# EAGLE design Keyboard_C64 (EAGLE 9.6.0)
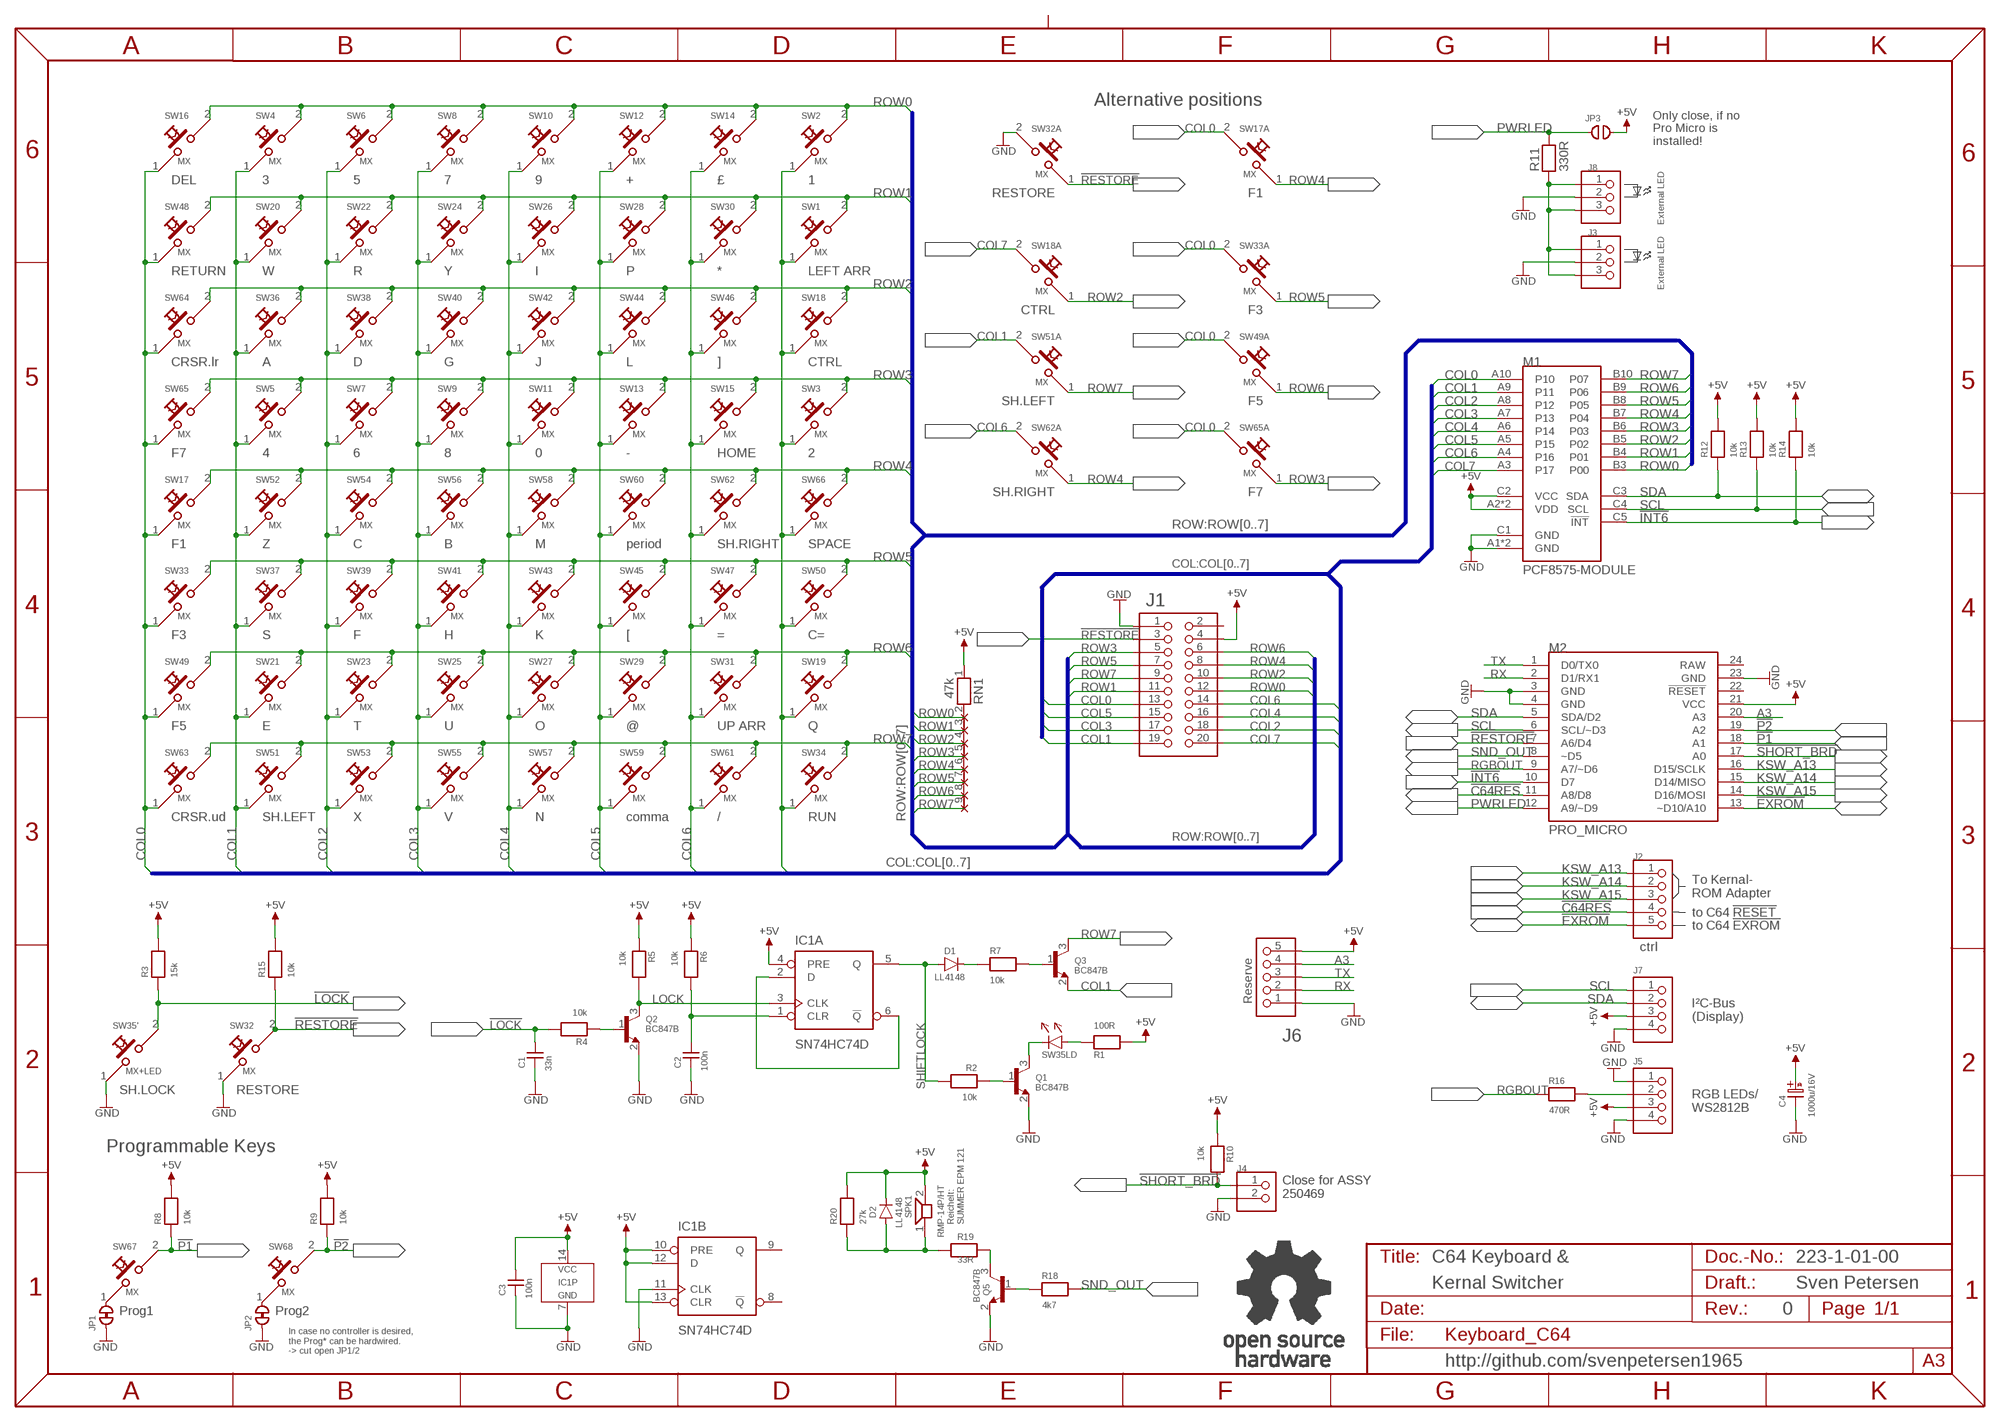
[diagram p0: schematic, sheet 1]

## Parts
C1  33n  C-0805  [0805]
C2  100n  C-0805  [0805]
C3  100n  C-0805  [0805]
C4  1000u/16V  C30X16L  [C30X16L]
D1  LL4148  [SOD80C]
D2  LL4148  [SOD80C]
IC1  SN74HC74D  7474HC  [SO-14]
J1  PINHD-2X10WH  [2X10WH]
J2  PINHD-1X590°  [1X05/90]
J3  PINHD-1X3/90  [1X03/90]
J4  PINHD-1X2/90  [1X02/90]
J5  PINHD-1X4/90  [1X04/90]
J6  PINHD-1X590°  [1X05/90]
J7  PINHD-1X4/90  [1X04/90]
J8  PINHD-1X3/90  [1X03/90]
JP1  CLOSED  [CP_CL]
JP2  CLOSED  [CP_CL]
JP3  OPEN  [CP_OP]
M1  PCF8575-MODULE  PCF8575-MODUL  [PCF8575MODUL]
M2  PRO_MICRO  [PRO_MICRO]
Q1  BC847B  BC846  [SOT23]
Q2  BC847B  BC846  [SOT23]
Q3  BC847B  BC846  [SOT23]
Q5  BC847B  BC846  [SOT23]
R1  100R  R-0805  [0805]
R2  10k  R-0805  [0805]
R3  15k  R-0805  [0805]
R4  10k  R-0805  [0805]
R5  10k  R-0805  [0805]
R6  10k  R-0805  [0805]
R7  10k  R-0805  [0805]
R8  10k  R-0805  [0805]
R9  10k  R-0805  [0805]
R10  10k  R-0805  [0805]
R11  330R  RES040805  [0805]
R12  10k  R-0805  [0805]
R13  10k  R-0805  [0805]
R14  10k  R-0805  [0805]
R15  10k  R-0805  [0805]
R16  470R  R-0805  [0805]
R18  4k7  R-0805  [0805]
R19  33R  R-0805  [0805]
R20  27k  R-0805  [0805]
RN1  47k  RN08  [RN-9]
SPK1  RMP-14P/HT  [RMP-14P/HT]
SW1  MX  [CHERRYMX]
SW2  MX  [CHERRYMX]
SW3  MX  [CHERRYMX]
SW4  MX  [CHERRYMX]
SW5  MX  [CHERRYMX]
SW6  MX  [CHERRYMX]
SW7  MX  [CHERRYMX]
SW8  MX  [CHERRYMX]
SW9  MX  [CHERRYMX]
SW10  MX  [CHERRYMX]
SW11  MX  [CHERRYMX]
SW12  MX  [CHERRYMX]
SW13  MX  [CHERRYMX]
SW14  MX  [CHERRYMX]
SW15  MX  [CHERRYMX]
SW16  MX  [CHERRYMX]
SW17  MX  [CHERRYMX]
SW17A  MX  [CHERRYMX]
SW18  MX  [CHERRYMX]
SW18A  MX  [CHERRYMX]
SW19  MX  [CHERRYMX]
SW20  MX  [CHERRYMX]
SW21  MX  [CHERRYMX]
SW22  MX  [CHERRYMX]
SW23  MX  [CHERRYMX]
SW24  MX  [CHERRYMX]
SW25  MX  [CHERRYMX]
SW26  MX  [CHERRYMX]
SW27  MX  [CHERRYMX]
SW28  MX  [CHERRYMX]
SW29  MX  [CHERRYMX]
SW30  MX  [CHERRYMX]
SW31  MX  [CHERRYMX]
SW32  MX  [CHERRYMX]
SW32A  MX  [CHERRYMX]
SW33  MX  [CHERRYMX]
SW33A  MX  [CHERRYMX]
SW34  MX  [CHERRYMX]
SW35  MX+LED  [CHERRYMXLD]
SW36  MX  [CHERRYMX]
SW37  MX  [CHERRYMX]
SW38  MX  [CHERRYMX]
SW39  MX  [CHERRYMX]
SW40  MX  [CHERRYMX]
SW41  MX  [CHERRYMX]
SW42  MX  [CHERRYMX]
SW43  MX  [CHERRYMX]
SW44  MX  [CHERRYMX]
SW45  MX  [CHERRYMX]
SW46  MX  [CHERRYMX]
SW47  MX  [CHERRYMX]
SW48  MX  [CHERRYMX]
SW49  MX  [CHERRYMX]
SW49A  MX  [CHERRYMX]
SW50  MX  [CHERRYMX]
SW51  MX  [CHERRYMX]
SW51A  MX  [CHERRYMX]
SW52  MX  [CHERRYMX]
SW53  MX  [CHERRYMX]
SW54  MX  [CHERRYMX]
SW55  MX  [CHERRYMX]
SW56  MX  [CHERRYMX]
SW57  MX  [CHERRYMX]
SW58  MX  [CHERRYMX]
SW59  MX  [CHERRYMX]
SW60  MX  [CHERRYMX]
SW61  MX  [CHERRYMX]
SW62  MX  [CHERRYMX]
SW62A  MX  [CHERRYMX]
SW63  MX  [CHERRYMX]
SW64  MX  [CHERRYMX]
SW65  MX  [CHERRYMX]
SW65A  MX  [CHERRYMX]
SW66  MX  [CHERRYMX]
SW67  MX  [CHERRYMX]
SW68  MX  [CHERRYMX]
U$90  OPEN_SOURCE_HW  [OPENHW]

## Nets
!C64RES: J2.4 M2.11(A8/D8)
!EXROM: J2.5 M2.13(~D10/A10)
!INT6: M1.C5(!INT) M2.10(D7) R14.1
!LOCK: C1.2 R3.1 R4.2 SW35.2
!P1: M2.18(A1) R8.1 SW67.2
!P2: M2.19(A2) R9.1 SW68.2
!RESTORE: J1.3 M2.7(A6/D4) R15.1 SW32.2 SW32A.1
!SHORT_BRD: J4.1 M2.17(A0) R10.2
+5V: C3.2 C4.A(+) D2.K IC1.4(A:PRE) IC1.10(B:PRE) IC1.12(B:D) IC1.13(B:CLR) IC1.14(P:VCC) J1.4 J5.3 J6.5 J7.3 JP3.2 M1.A2(VDD) M1.B2(VDD) M1.C2(VCC) M2.21(VCC) R1.2 R3.2 R5.1 R6.1 R8.2 R9.2 R10.1 R12.2 R13.2 R14.2 R15.2 R20.2 RN1.1 SPK1.2
A3: J6.4 M2.20(A3)
COL0: J1.13 M1.A10(P10) SW16.1 SW17.1 SW17A.2 SW33.1 SW33A.2 SW48.1 SW49.1 SW49A.2 SW63.1 SW64.1 SW65.1 SW65A.2
COL1: J1.19 M1.A9(P11) Q3.2(E) SW4.1 SW5.1 SW20.1 SW21.1 SW36.1 SW37.1 SW51.1 SW51A.2 SW52.1
COL2: J1.18 M1.A8(P12) SW6.1 SW7.1 SW22.1 SW23.1 SW38.1 SW39.1 SW53.1 SW54.1
COL3: J1.17 M1.A7(P13) SW8.1 SW9.1 SW24.1 SW25.1 SW40.1 SW41.1 SW55.1 SW56.1
COL4: J1.16 M1.A6(P14) SW10.1 SW11.1 SW26.1 SW27.1 SW42.1 SW43.1 SW57.1 SW58.1
COL5: J1.15 M1.A5(P15) SW12.1 SW13.1 SW28.1 SW29.1 SW44.1 SW45.1 SW59.1 SW60.1
COL6: J1.14 M1.A4(P16) SW14.1 SW15.1 SW30.1 SW31.1 SW46.1 SW47.1 SW61.1 SW62.1 SW62A.2
COL7: J1.20 M1.A3(P17) SW1.1 SW2.1 SW3.1 SW18.1 SW18A.2 SW19.1 SW34.1 SW50.1 SW66.1
GND: C1.1 C2.1 C3.1 C4.K(-) IC1.7(P:GND) IC1.11(B:CLK) J1.1 J3.2 J4.2 J5.1 J5.4 J6.1 J7.4 J8.2 JP1.1 JP2.1 M1.A1(GND) M1.B1(GND) M1.C1(GND) M2.3(GND) M2.4(GND) M2.23(GND) Q1.2(E) Q2.2(E) Q5.2(E) SW32.1 SW32A.2 SW35.1
KSW_A13: J2.1 M2.16(D15/SCLK)
KSW_A14: J2.2 M2.15(D14/MISO)
KSW_A15: J2.3 M2.14(D16/MOSI)
LOCK: IC1.3(A:CLK) Q2.3(C) R5.2
N$1: R1.1 SW35.LDA(LD:A)
N$2: Q1.3(C) SW35.LDC(LD:K)
N$3: Q1.1(B) R2.1
N$4: Q2.1(B) R4.1
N$5: IC1.2(A:D) IC1.6(A:!Q)
N$6: C2.2 IC1.1(A:CLR) R6.2
N$7: D1.K R7.1
N$8: Q3.1(B) R7.2
N$9: Q5.1(B) R18.1
N$10: J3.1 J3.3 J8.1 J8.3 R11.1
N$11: Q5.3(C) R19.2
N$12: D2.A R19.1 R20.1 SPK1.1
N$13: J5.2 R16.2
N$14: JP1.2 SW67.1
N$15: JP2.2 SW68.1
PWRLED: JP3.1 M2.12(A9/~D9) R11.2
RGBOUT: M2.9(A7/~D6) R16.1
ROW0: J1.12 M1.B3(P00) RN1.2 SW2.2 SW4.2 SW6.2 SW8.2 SW10.2 SW12.2 SW14.2 SW16.2
ROW1: J1.11 M1.B4(P01) RN1.3 SW1.2 SW20.2 SW22.2 SW24.2 SW26.2 SW28.2 SW30.2 SW48.2
ROW2: J1.10 M1.B5(P02) RN1.4 SW18.2 SW18A.1 SW36.2 SW38.2 SW40.2 SW42.2 SW44.2 SW46.2 SW64.2
ROW3: J1.5 M1.B6(P03) RN1.5 SW3.2 SW5.2 SW7.2 SW9.2 SW11.2 SW13.2 SW15.2 SW65.2 SW65A.1
ROW4: J1.8 M1.B7(P04) RN1.6 SW17.2 SW17A.1 SW52.2 SW54.2 SW56.2 SW58.2 SW60.2 SW62.2 SW62A.1 SW66.2
ROW5: J1.7 M1.B8(P05) RN1.7 SW33.2 SW33A.1 SW37.2 SW39.2 SW41.2 SW43.2 SW45.2 SW47.2 SW50.2
ROW6: J1.6 M1.B9(P06) RN1.8 SW19.2 SW21.2 SW23.2 SW25.2 SW27.2 SW29.2 SW31.2 SW49.2 SW49A.1
ROW7: J1.9 M1.B10(P07) Q3.3(C) RN1.9 SW34.2 SW51.2 SW51A.1 SW53.2 SW55.2 SW57.2 SW59.2 SW61.2 SW63.2
RX: J6.2 M2.2(D1/RX1)
SCL: J7.1 M1.C4(SCL) M2.6(SCL/~D3) R13.1
SDA: J7.2 M1.C3(SDA) M2.5(SDA/D2) R12.1
SHIFTLOCK: D1.A IC1.5(A:Q) R2.2
SND_OUT: M2.8(~D5) R18.2
TX: J6.3 M2.1(D0/TX0)
Unconnected: IC1.8(B:!Q) IC1.9(B:Q) J1.2 M2.22(!RESET)

## Buses
COL:COL[0..7]
ROW:ROW[0..7]

## Notes on the sheet
- Alternative positions
- Only close, if no
  Pro Micro is 
  installed!
- External LED
- External LED
- To Kernal-
  ROM Adapter
- to C64 !RESET
- to C64 !EXROM
- ctrl
- Reserve
- I²C-Bus
  (Display)
- RGB LEDs/
  WS2812B
- Programmable Keys
- Close for ASSY
  250469
- Reichelt:
  SUMMER EPM 121
- C64 Keyboard & | 223-1-01-00
- Kernal Switcher | Sven Petersen
- 0
- In case no controller is desired,
  the Prog* can be hardwired.
  -> cut open JP1/2
- http://github.com/svenpetersen1965

## Power pins joined to a net without a drawn wire
RAW: M2.24(RAW)

## Library data of the parts
C1-C3 = SMD:C-0805
C4 = ELCO:C30X16L
D1 D2 = Dioden:LL4148
IC1 = 74XXsmd:7474*: Dual D-Flip-Flop SO14
J1 = PINHEAD:PINHD-2X10
J2 J6 = PINHEAD:PINHD-1X5
J3 J8 = PINHEAD:PINHD-1X3
J4 = PINHEAD:PINHD-1X2
J5 J7 = PINHEAD:PINHD-1X4
JP1 JP2 = Cutpad:CLOSED: Closed Cutpad
JP3 = Cutpad:OPEN: open Cutpad
M1 = Arduino:PCF8575-MODUL
M2 = Arduino:PRO_MICRO
Q1-Q3 Q5 = Transistoren:BC846
R1-R10 R12-R16 R18-R20 = SMD:R-0805
R11 = DISCRETE:RES04
RN1 = DISCRETE:RN08
SPK1 = KM:RMP-14P/HT
SW1 = CherryMX:MX; KEY: LEFT ARR
SW2 = CherryMX:MX; KEY: 1
SW3 = CherryMX:MX; KEY: 2
SW4 = CherryMX:MX; KEY: 3
SW5 = CherryMX:MX; KEY: 4
SW6 = CherryMX:MX; KEY: 5
SW7 = CherryMX:MX; KEY: 6
SW8 = CherryMX:MX; KEY: 7
SW9 = CherryMX:MX; KEY: 8
SW10 = CherryMX:MX; KEY: 9
SW11 = CherryMX:MX; KEY: 0
SW12 = CherryMX:MX; KEY: +
SW13 = CherryMX:MX; KEY: -
SW14 = CherryMX:MX; KEY: £
SW15 = CherryMX:MX; KEY: HOME
SW16 = CherryMX:MX; KEY: DEL
SW17 SW17A = CherryMX:MX; KEY: F1
SW18 SW18A = CherryMX:MX; KEY: CTRL
SW19 = CherryMX:MX; KEY: Q
SW20 = CherryMX:MX; KEY: W
SW21 = CherryMX:MX; KEY: E
SW22 = CherryMX:MX; KEY: R
SW23 = CherryMX:MX; KEY: T
SW24 = CherryMX:MX; KEY: Y
SW25 = CherryMX:MX; KEY: U
SW26 = CherryMX:MX; KEY: I
SW27 = CherryMX:MX; KEY: O
SW28 = CherryMX:MX; KEY: P
SW29 = CherryMX:MX; KEY: @
SW30 = CherryMX:MX; KEY: *
SW31 = CherryMX:MX; KEY: UP ARR
SW32 SW32A = CherryMX:MX; KEY: RESTORE
SW33 SW33A = CherryMX:MX; KEY: F3
SW34 = CherryMX:MX; KEY: RUN
SW35 = CherryMX:MX+LED; KEY: SH.LOCK
SW36 = CherryMX:MX; KEY: A
SW37 = CherryMX:MX; KEY: S
SW38 = CherryMX:MX; KEY: D
SW39 = CherryMX:MX; KEY: F
SW40 = CherryMX:MX; KEY: G
SW41 = CherryMX:MX; KEY: H
SW42 = CherryMX:MX; KEY: J
SW43 = CherryMX:MX; KEY: K
SW44 = CherryMX:MX; KEY: L
SW45 = CherryMX:MX; KEY: [
SW46 = CherryMX:MX; KEY: ]
SW47 = CherryMX:MX; KEY: =
SW48 = CherryMX:MX; KEY: RETURN
SW49 SW49A = CherryMX:MX; KEY: F5
SW50 = CherryMX:MX; KEY: C=
SW51 SW51A = CherryMX:MX; KEY: SH.LEFT
SW52 = CherryMX:MX; KEY: Z
SW53 = CherryMX:MX; KEY: X
SW54 = CherryMX:MX; KEY: C
SW55 = CherryMX:MX; KEY: V
SW56 = CherryMX:MX; KEY: B
SW57 = CherryMX:MX; KEY: N
SW58 = CherryMX:MX; KEY: M
SW59 = CherryMX:MX; KEY: comma
SW60 = CherryMX:MX; KEY: period
SW61 = CherryMX:MX; KEY: /
SW62 SW62A = CherryMX:MX; KEY: SH.RIGHT
SW63 = CherryMX:MX; KEY: CRSR.ud
SW64 = CherryMX:MX; KEY: CRSR.lr
SW65 SW65A = CherryMX:MX; KEY: F7
SW66 = CherryMX:MX; KEY: SPACE
SW67 = CherryMX:MX; KEY: Prog1
SW68 = CherryMX:MX; KEY: Prog2
U$90 = Logo:OPEN_SOURCE_HW

## Board
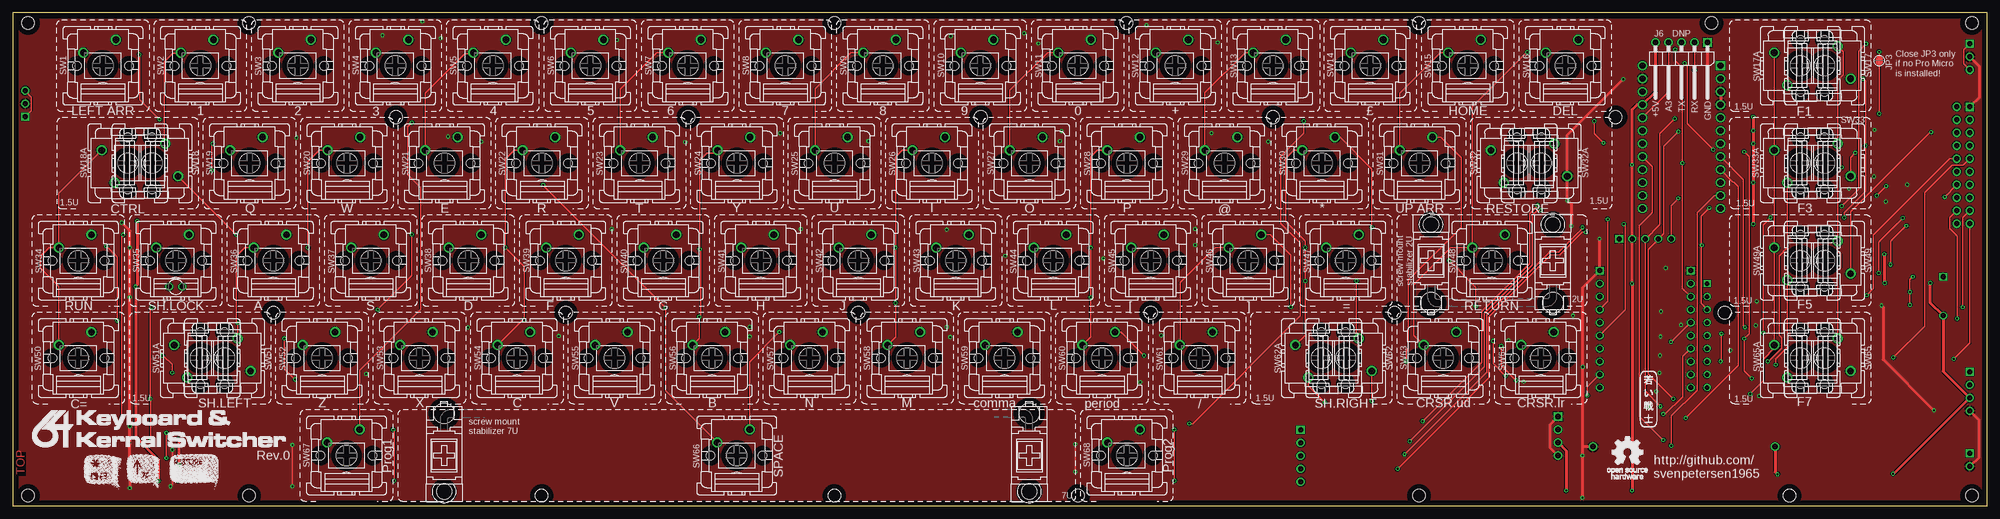
[diagram p1: board, top side]
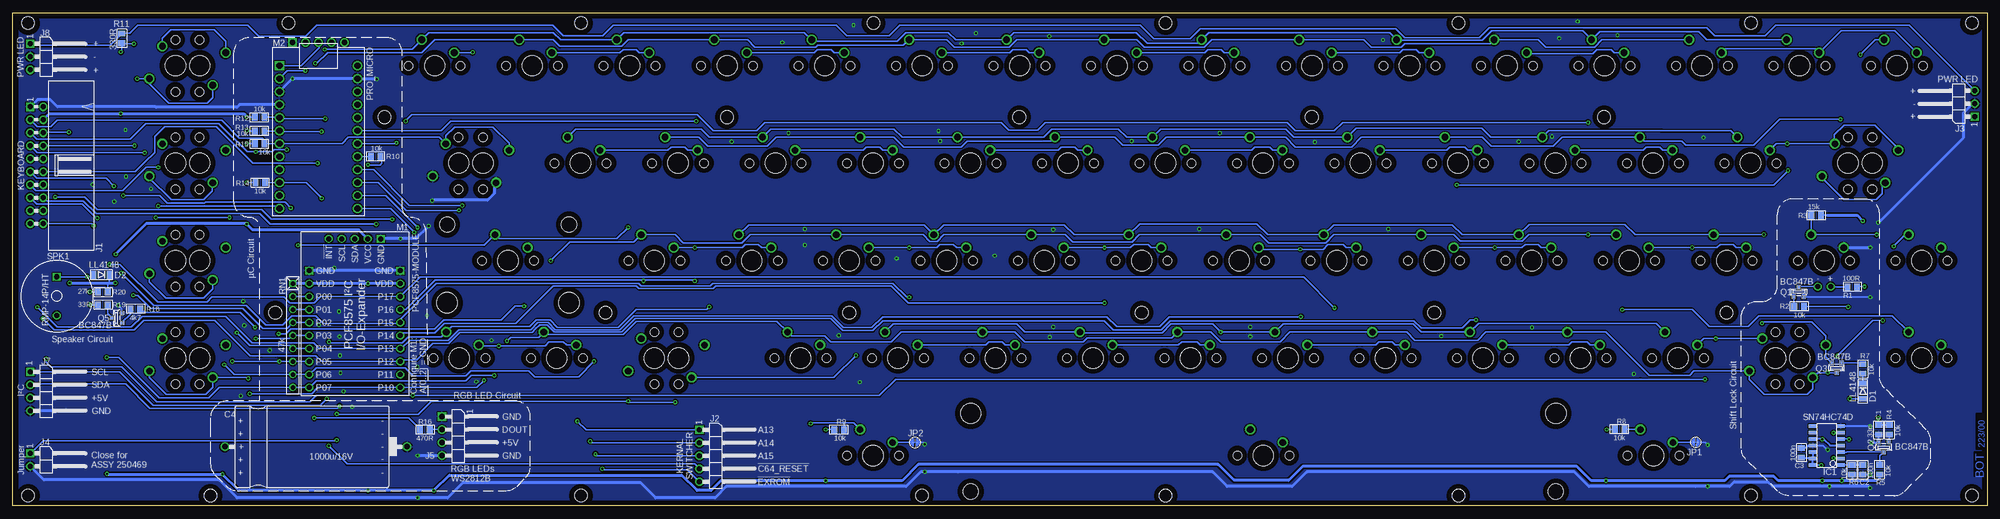
[diagram p2: board, bottom side, seen from below]

Size 385.6 x 96.4 mm. Coordinates in mm from the lower left corner, seen from the top.
Outline: 0,0 385.6,0 385.6,96.4 0,96.4 0,0
Copper layers (1*16): Top 0.035mm / dielectric 1.5mm / Bottom 0.035mm
Design rules "default *": minimum track width 6mil, minimum drill 0.35mm, track to track 6mil, track to pad 6mil, pad to pad 6mil, via to via 6mil, smd to smd 6mil, copper to edge 40mil, drill to drill 6mil, minimum pad ring 10mil, minimum via ring 8mil, stop-mask expansion 4mil, vias tented up to drill 25mil, thermal gap 10mil
Holes 2.5 mm at 3,94.4 3,2 46.16,94.4 103.29,94.4 160.44,94.4 217.52,94.4 274.64,94.4 331.76,94.4 382.6,94.4 46.16,2 103.29,2 160.44,2 208.06,2 274.64,2 347,2 382.6,2 74.8,76 131.92,76 189.04,76 246.14,76 313,76 50.88,37.8 108,37.8 165.12,37.8 222.24,37.8 269.84,37.8 334.34,37.8
tRestrict: area 1,92.4 to 5,96.4; area 44.2,92.4 to 48.2,96.4; area 101.3,92.4 to 105.3,96.4; area 158.4,92.4 to 162.4,96.4; area 215.5,92.4 to 219.5,96.4; area 272.6,92.4 to 276.6,96.4; area 329.8,92.4 to 333.8,96.4; area 380.6,92.4 to 384.6,96.4; area 72.8,74 to 76.8,78; area 129.9,74 to 133.9,78; area 187,74 to 191,78; area 244.1,74 to 248.1,78; area 311,74 to 315,78; area 48.9,35.8 to 52.9,39.8; area 106,35.8 to 110,39.8; area 163.1,35.8 to 167.1,39.8; area 220.2,35.8 to 224.2,39.8; area 267.8,35.8 to 271.8,39.8; area 332.3,35.8 to 336.3,39.8; area 380.6,0 to 384.6,4; area 272.6,0 to 276.6,4; area 206.1,0 to 210.1,4; area 158.4,0 to 162.4,4; area 101.3,0 to 105.3,4; area 44.2,0 to 48.2,4; area 1,0 to 5,4; area 345,0 to 349,4; area 82.2,0.8 to 86.2,4.8; area 196.5,0.8 to 200.5,4.8; area 275,53 to 279,57; area 298.8,53 to 302.8,57
bRestrict: area 1,92.4 to 5,96.4; area 44.2,92.4 to 48.2,96.4; area 101.3,92.4 to 105.3,96.4; area 158.4,92.4 to 162.4,96.4; area 215.5,92.4 to 219.5,96.4; area 272.6,92.4 to 276.6,96.4; area 329.8,92.4 to 333.8,96.4; area 380.6,92.4 to 384.6,96.4; area 72.8,74 to 76.8,78; area 129.9,74 to 133.9,78; area 187,74 to 191,78; area 244.1,74 to 248.1,78; area 311,74 to 315,78; area 48.9,35.8 to 52.9,39.8; area 106,35.8 to 110,39.8; area 163.1,35.8 to 167.1,39.8; area 220.2,35.8 to 224.2,39.8; area 267.8,35.8 to 271.8,39.8; area 332.3,35.8 to 336.3,39.8; area 380.6,0 to 384.6,4; area 272.6,0 to 276.6,4; area 206.1,0 to 210.1,4; area 158.4,0 to 162.4,4; area 101.3,0 to 105.3,4; area 44.2,0 to 48.2,4; area 1,0 to 5,4; area 345,0 to 349,4; area 82.2,0.8 to 86.2,4.8; area 196.5,0.8 to 200.5,4.8; area 275,53 to 279,57; area 298.8,53 to 302.8,57; 3 lines

### Footprints (pad centres in the part's own frame; a part is rotated, then mirrored left to right if it is on the bottom)
0805 = smd 1.092 x 1.397: 1 -0.94,0; 2 0.94,0
C30X16L = drill 1.016 pad 1.651: A -17.78,0; K 17.78,0
SOD80C = smd 1 x 1.6: A -1.5,0; K 1.5,0
SO-14 = smd 0.61 x 1.524: 1 -3.81,-2.794; 2 -2.54,-2.794; 3 -1.27,-2.794; 4 0,-2.794; 5 1.27,-2.794; 6 2.54,-2.794; 7 3.81,-2.794; 8 3.81,2.667; 9 2.54,2.667; 10 1.27,2.667; 11 0,2.667; 12 -1.27,2.667; 13 -2.54,2.667; 14 -3.81,2.667
2X10WH = drill 1 pad 1.626 square: 1 -11.43,-1.27 | drill 1 pad 1.626: 2 -11.43,1.27; 3 -8.89,-1.27; 4 -8.89,1.27; 5 -6.35,-1.27; 6 -6.35,1.27; 7 -3.81,-1.27; 8 -3.81,1.27; 9 -1.27,-1.27; 10 -1.27,1.27; 11 1.27,-1.27; 12 1.27,1.27; 13 3.81,-1.27; 14 3.81,1.27; 15 6.35,-1.27; 16 6.35,1.27; 17 8.89,-1.27; 18 8.89,1.27; 19 11.43,-1.27; 20 11.43,1.27
1X05/90 = drill 1 pad 1.626 square: 1 -5.08,0 | drill 1 pad 1.626: 2 -2.54,0; 3 0,0; 4 2.54,0; 5 5.08,0
1X03/90 = drill 1 pad 1.626 square: 1 -2.54,0 | drill 1 pad 1.626: 2 0,0; 3 2.54,0
1X02/90 = drill 1 pad 1.626 square: 1 -1.27,0 | drill 1 pad 1.626: 2 1.27,0
1X04/90 = drill 1 pad 1.626 square: 1 -3.81,0 | drill 1 pad 1.626: 2 -1.27,0; 3 1.27,0; 4 3.81,0
CP_CL = smd 0.152 x 0.152: 1 -0.4,0; 2 0.4,0
CP_OP = smd 0.152 x 0.152: 1 -0.4,0; 2 0.4,0
PCF8575MODUL = drill 1 square: A1 -8.89,-8.5; B1 8.89,-8.5; C1 -5.08,-14.7 | drill 1: A2 -8.89,-5.96; A3 -8.89,-3.42; A4 -8.89,-0.88; A5 -8.89,1.66; A6 -8.89,4.2; A7 -8.89,6.74; A8 -8.89,9.28; A9 -8.89,11.82; A10 -8.89,14.36; B2 8.89,-5.96; B3 8.89,-3.42; B4 8.89,-0.88; B5 8.89,1.66; B6 8.89,4.2; B7 8.89,6.74; B8 8.89,9.28; B9 8.89,11.82; B10 8.89,14.36; C2 -2.54,-14.7; C3 0,-14.7; C4 2.54,-14.7; C5 5.08,-14.7
PRO_MICRO = drill 1.2 square: 1 -7.62,13.97 | drill 1.2: 2 -7.62,11.43; 3 -7.62,8.89; 4 -7.62,6.35; 5 -7.62,3.81; 6 -7.62,1.27; 7 -7.62,-1.27; 8 -7.62,-3.81; 9 -7.62,-6.35; 10 -7.62,-8.89; 11 -7.62,-11.43; 12 -7.62,-13.97; 13 7.62,-13.97; 14 7.62,-11.43; 15 7.62,-8.89; 16 7.62,-6.35; 17 7.62,-3.81; 18 7.62,-1.27; 19 7.62,1.27; 20 7.62,3.81; 21 7.62,6.35; 22 7.62,8.89; 23 7.62,11.43; 24 7.62,13.97
SOT23 = smd 0.8 x 0.9: 1 -0.953,-0.953; 2 0.953,-0.953; 3 0,0.953
RN-9 = drill 0.889 pad 1.397 square: 1 -10.16,0 | drill 0.889 pad 1.397: 2 -7.62,0; 3 -5.08,0; 4 -2.54,0; 5 0,0; 6 2.54,0; 7 5.08,0; 8 7.62,0; 9 10.16,0
RMP-14P/HT = drill 1 square: 1 0,3.8 | drill 1: 2 0,-3.8
CHERRYMX = drill 1.3: 1 -3.81,2.54; 2 2.54,5.08 | hole 4: 0,0 | hole 1.7: 5.08,0; -5.08,0
CHERRYMXLD = drill 1.3: 1 -3.81,2.54; 2 2.54,5.08 | drill 1: LDA -1.27,-5.08; LDC 1.27,-5.08 | hole 4: 0,0 | hole 1.7: -5.08,0; 5.08,0
STABIL_PIN_SCREW_L = hole 3: 0,7.05 | hole 4: 0,-8.24
STABIL_PIN_SCREW = hole 3: 0,7.05 | hole 4: 0,-8.24

### Placement (x,y rotation side)
C1  21.2,14.9 90 bottom
C2  24.3,7.1 90 bottom
C3  36.3,10.4 270 bottom
C4  326.39,11.59 0 bottom
D1  24.3,22.4 90 bottom
D2  368.26,45.17 0 bottom
IC1  31.4,11.8 90 bottom
J1  380.93,66.6 270 bottom
J2  251.5,9.8 270 bottom
J3  2.42,78.62 90 bottom
J4  382.2,9 270 bottom
J5  301.78,13.65 270 bottom
J6  325.9,90.6 180 top
J7  382.2,22.4 270 bottom
J8  382.2,87.8 270 bottom
JP1  56.92,12.41 180 bottom
JP2  209.4,12.4 180 bottom
JP3  364.5,87.02 270 top
M1  318.8,37.5 180 bottom
M2  325.9,72.1 0 bottom
Q1  36.79,41.82 0 bottom
Q2  20.2,11.5 180 bottom
Q3  29.4,27 180 bottom
Q5  365.26,36.73 90 bottom
R1  26.37,42.82 0 bottom
R2  36.75,39.02 0 bottom
R3  33.43,56.82 0 bottom
R4  19.1,14.9 90 bottom
R5  21,7.1 90 bottom
R6  26.4,7.1 90 bottom
R7  24.3,26.8 90 bottom
R8  71.81,15.01 180 bottom
R9  224.23,14.89 180 bottom
R10  314.7,68.3 180 bottom
R11  364.3,91.4 270 bottom
R12  337.4,76 180 bottom
R13  337.4,73.3 180 bottom
R14  337.3,63.2 180 bottom
R15  337.4,70.8 180 bottom
R16  305.12,14.92 0 bottom
R18  361.65,38.52 0 bottom
R19  368,39.3 0 bottom
R20  368,41.8 0 bottom
RN1  330.9,33.3 270 bottom
SPK1  377,41 0 bottom
SW1  17.6,86.05 0 top
SW2  36.64,86.05 0 top
SW3  55.68,86.05 0 top
SW4  74.72,86.05 0 top
SW5  93.76,86.05 0 top
SW6  112.8,86.05 0 top
SW7  131.84,86.05 0 top
SW8  150.88,86.05 0 top
SW9  169.92,86.05 0 top
SW10  188.96,86.05 0 top
SW11  208,86.05 0 top
SW12  227.04,86.05 0 top
SW13  246.08,86.05 0 top
SW14  265.12,86.05 0 top
SW15  284.16,86.05 0 top
SW16  303.2,86.05 0 top
SW17  353.85,86.05 270 top
SW17A  349.1,86.05 90 top
SW18  27.2,67 270 top
SW18A  22.45,67 90 top
SW19  46.24,67 0 top
SW20  65.28,67 0 top
SW21  84.32,67 0 top
SW22  103.36,67 0 top
SW23  122.4,67 0 top
SW24  141.44,67 0 top
SW25  160.48,67 0 top
SW26  179.52,67 0 top
SW27  198.56,67 0 top
SW28  217.6,67 0 top
SW29  236.64,67 0 top
SW30  255.68,67 0 top
SW31  274.72,67 0 top
SW32  293.76,67 90 top
SW32A  298.51,67 270 top
SW33  353.85,67 270 top
SW33A  349.1,67 90 top
SW34  12.8,47.95 0 top
SW35  31.84,47.95 0 top
SW36  50.88,47.95 0 top
SW37  69.92,47.95 0 top
SW38  88.96,47.95 0 top
SW39  108,47.95 0 top
SW40  127.04,47.95 0 top
SW41  146.08,47.95 0 top
SW42  165.12,47.95 0 top
SW43  184.16,47.95 0 top
SW44  203.2,47.95 0 top
SW45  222.24,47.95 0 top
SW46  241.28,47.95 0 top
SW47  260.32,47.95 0 top
SW48  288.88,47.95 0 top
SW49  353.85,47.95 270 top
SW49A  349.1,47.95 90 top
SW50  12.8,28.9 0 top
SW51  41.36,28.9 270 top
SW51A  36.61,28.9 90 top
SW52  60.4,28.9 0 top
SW53  79.44,28.9 0 top
SW54  98.48,28.9 0 top
SW55  117.52,28.9 0 top
SW56  136.56,28.9 0 top
SW57  155.6,28.9 0 top
SW58  174.64,28.9 0 top
SW59  193.68,28.9 0 top
SW60  212.72,28.9 0 top
SW61  231.76,28.9 0 top
SW62  260.32,28.9 270 top
SW62A  255.57,28.9 90 top
SW63  279.36,28.9 0 top
SW64  298.4,28.9 0 top
SW65  353.85,28.9 270 top
SW65A  349.1,28.9 90 top
SW66  141.38,9.85 0 top
SW67  65.18,9.85 0 top
SW68  217.58,9.85 0 top
U$90  311.4,5.26 0 top
U$92  [KCAP_1_5U]  349.1,86.05 0 top
U$93  [KCAP_1_5U]  349.1,67 0 top
U$94  [KCAP_1_5U]  349.1,47.95 0 top
U$95  [KCAP_1_5U]  349.1,28.9 0 top
U$96  [KCAP_1_5U]  255.57,28.9 0 top
U$97  [KCAP_1_5U]  22.45,67 0 top
U$98  [KCAP_1_5U]  36.61,28.9 0 top
U$99  [KCAP_1U]  65.18,9.85 0 top
U$100  [KCAP_1U]  217.58,9.85 0 top
U$101  [KCAP_1U]  17.6,86.05 0 top
U$102  [KCAP_1U]  303.2,86.05 0 top
U$103  [KCAP_1U]  298.4,28.9 0 top
U$104  [KCAP_7U]  141.38,9.85 0 top
U$105  [KCAP_2U]  288.88,47.95 0 top
U$106  [KCAP_1_5U]  298.51,67 0 top
U$107  [KCAP_1U]  12.8,47.95 0 top
U$108  [KCAP_1U]  12.8,28.9 0 top
U$109  [KCAP_1U]  36.64,86.05 0 top
U$110  [KCAP_1U]  55.68,86.05 0 top
U$111  [KCAP_1U]  74.72,86.05 0 top
U$112  [KCAP_1U]  93.76,86.05 0 top
U$113  [KCAP_1U]  112.8,86.05 0 top
U$114  [KCAP_1U]  131.84,86.05 0 top
U$115  [KCAP_1U]  150.88,86.05 0 top
U$116  [KCAP_1U]  169.92,86.05 0 top
U$117  [KCAP_1U]  188.96,86.05 0 top
U$118  [KCAP_1U]  208,86.05 0 top
U$119  [KCAP_1U]  227.04,86.05 0 top
U$120  [KCAP_1U]  246.2,86.05 0 top
U$121  [KCAP_1U]  265.12,86.05 0 top
U$122  [KCAP_1U]  284.16,86.05 0 top
U$123  [KCAP_1U]  46.24,67 0 top
U$124  [KCAP_1U]  65.28,67 0 top
U$125  [KCAP_1U]  84.32,67 0 top
U$126  [KCAP_1U]  103.36,67 0 top
U$127  [KCAP_1U]  122.4,67 0 top
U$128  [KCAP_1U]  141.44,67 0 top
U$129  [KCAP_1U]  160.48,67 0 top
U$130  [KCAP_1U]  179.52,67 0 top
U$131  [KCAP_1U]  198.56,67 0 top
U$132  [KCAP_1U]  217.6,67 0 top
U$133  [KCAP_1U]  236.64,67 0 top
U$134  [KCAP_1U]  255.68,67 0 top
U$135  [KCAP_1U]  274.72,67 0 top
U$136  [KCAP_1U]  50.88,47.95 0 top
U$137  [KCAP_1U]  69.92,47.95 0 top
U$138  [KCAP_1U]  88.96,47.95 0 top
U$139  [KCAP_1U]  108,47.95 0 top
U$140  [KCAP_1U]  127.04,47.95 0 top
U$141  [KCAP_1U]  146.08,47.95 0 top
U$142  [KCAP_1U]  165.12,47.95 0 top
U$143  [KCAP_1U]  184.16,47.95 0 top
U$144  [KCAP_1U]  203.2,47.95 0 top
U$145  [KCAP_1U]  222.24,47.95 0 top
U$146  [KCAP_1U]  241.28,47.95 0 top
U$147  [KCAP_1U]  260.32,47.95 0 top
U$148  [KCAP_1U]  31.84,47.95 0 top
U$149  [KCAP_1U]  60.4,28.9 0 top
U$150  [KCAP_1U]  79.44,28.9 0 top
U$151  [KCAP_1U]  98.48,28.9 0 top
U$152  [KCAP_1U]  117.52,28.9 0 top
U$153  [KCAP_1U]  136.56,28.9 0 top
U$154  [KCAP_1U]  155.6,28.9 0 top
U$155  [KCAP_1U]  174.64,28.9 0 top
U$156  [KCAP_1U]  193.68,28.9 0 top
U$157  [KCAP_1U]  212.72,28.9 0 top
U$158  [KCAP_1U]  231.76,28.9 0 top
U$159  [KCAP_1U]  279.36,28.9 0 top
U$161  [2LAYER]  2.32,6.05 90 top
U$162  [PCB-TITLE/]  -0.16,128.59 0 top  (outside the outline)
U$164  [C64_KEYS]  13.83,2.65 0 top
U$172  [STABIL_PIN_SCREW_L]  276.98,47.95 0 top
U$173  [STABIL_PIN_SCREW]  300.78,47.94 0 top
U$174  [STABIL_PIN_SCREW]  84.23,9.85 180 top
U$175  [STABIL_PIN_SCREW_L]  198.53,9.85 180 top
U$176  [64KB]  3.8,11.5 0 top
U$178  [SVEN_TAG]  319.5,21 0 top

### Tracks (layer width: path | path; a pad name or v marks a point on that pad's centre or on a via)
!C64RES  (via drill 0.35)
  Top 0.254: v323.88,11.77 323.88,17.57 328.93,22.61 328.93,57.31 332.26,60.64 333.49,60.64 M2.11
  Bottom 0.254: v323.88,11.77 320.33,8.21 252.45,8.21 J2.4
!EXROM  (via drill 0.35)
  Top 0.254: v270.46,7.24 288.29,25.07 288.29,36.99 294.32,43.02 300.38,49.08 302.08,49.08 306.5,53.5 v307.2,53.5
  Bottom 0.254: J2.5 253.88,7.1 270.32,7.1 v270.46,7.24 | v307.2,53.5 311.81,58.1 311.81,58.13 M2.13
!INT6  (via drill 0.35)
  Top 0.254: M1.C5 323.88,58.72 v325.29,60.12
  Bottom 0.254: R14.1 M2.10 | M2.10 328.33,63.2 325.29,60.16 v325.29,60.12 | M2.10
!LOCK  (via drill 0.35)
  Top 0.254: v21.27,17.14 21.27,52.7 v21.59,53.02
  Bottom 0.254: R4.2 C1.2 21.27,15.91 v21.27,17.14 | v21.59,53.02 SW35.2 34.38,56.58 33.97,56.99 34.2,56.99 R3.1
!P1  (via drill 0.35)
  Top 0.254: SW67.2 67.72,26.45 79.69,38.42 79.69,62.23 77.15,64.77 77.15,74.14 v77.95,74.93 | v308.86,75.25 308.86,72.77 v310.67,70.96
  Bottom 0.254: R8.1 69.85,15.01 69.53,15.01 69.22,15.01 67.8,15.01 SW67.2 | v77.95,74.93 125.89,74.93 127.48,73.34 135.1,73.34 136.68,74.93 183.99,74.93 185.46,73.47 191.07,73.47 192.53,74.93 238.76,74.93 240.35,73.34 248.76,73.34 251.94,76.52 307.66,76.52 308.86,75.31 v308.86,75.25 | v310.67,70.96 310.83,70.8 318.25,70.8 M2.18
!P2  (via drill 0.35)
  Top 0.254: v252.09,75.25 252.09,72.87 247.65,68.42 247.65,55.24 251.46,51.44 251.46,37.15 230.4,16.09 v229.78,16.09
  Bottom 0.254: SW68.2 221.38,16.19 223.2,16.19 | R9.1 223.2,14.98 223.2,15.89 223.2,16.19 | M2.19 301.92,73.37 300.04,75.25 v252.09,75.25 | v229.78,16.09 229.68,16.19 223.2,16.19
!RESTORE
  Bottom 0.254: SW32.2 288.68,70.88 291.88,74.07 299.34,74.07 301.05,72.36 SW32A.1 302.31,72.07 320.05,72.07 321.3,70.83 M2.7 333.55,70.8 336.39,70.8 | R15.1 336.39,70.8 | 336.39,70.8 336.55,70.96 336.55,71.6 336.87,71.91 341.34,71.91 344.83,75.41 376.87,75.41 378.14,74.14 380.85,74.14 J1.3
!SHORT_BRD  (via drill 0.35)
  Top 0.254: M2.17 320.2,66.37 320.2,57.31 317.66,54.77 317.66,17.55 v322.35,12.86
  Bottom 0.254: R10.2 M2.17 | v322.35,12.86 322.49,12.72 379.69,12.72 382.14,10.27 J4.1
+5V  (via drill 0.35)
  Top 0.152: v364.5,76.68 v364.49,76.68
  Top 0.254: v74.3,14.92 74.45,14.76 v74.45,4.92 | v226.85,14.92 v226.85,4.92 | JP3.2 v364.5,76.68
  Top 0.61: v32.23,13.02 32.38,12.86 v32.38,7.94 32.38,5.08 v32.23,4.92 | v24.29,55.72 24.29,43.18 v23.97,42.86 23.97,13.49 28.42,9.05 v28.42,4.92 | v339.88,76.04 v339.88,73.34 v339.88,70.8 v339.88,63.18 v339.88,55.09 | v374.49,43.58 374.49,39.71 SPK1.2 377,26.33 J7.3 367.35,6.28 v367.21,6.28 | v365.5,49.19 365.5,43.68 v365.6,43.58 | v316.23,3.02 v316.23,43.46 316.26,43.49 M1.C2 316.26,55.06 316.23,55.09 v316.23,66.67 316.23,77.47 317.21,78.45 M2.21 320.82,80.99 J6.5 | J5.3 303.37,10.79 v303.37,3.02 | v344.65,6.19 344.17,6.67 C4.A
  Bottom 0.254: R3.2 31.29,56.82 31.27,56.83 | v23.97,42.86 25.39,42.86 R1.2 | R8.2 72.83,14.92 v74.3,14.92 | R9.2 225.2,14.92 v226.85,14.92 | R12.2 339.84,76 v339.88,76.04 | R13.2 339.84,73.3 v339.88,73.34 | R15.2 v339.88,70.8 | R20.2 367.06,43.55 367.03,43.58 | D2.K 366.76,43.63 366.71,43.58 | v316.23,66.67 313.85,66.67 313.53,66.99 313.53,68.07 R10.1 | R14.2 339.87,63.2 v339.88,63.18
  Bottom 0.406: IC1.13 IC1.14 32.44,7.99 v32.38,7.94 | IC1.4 30.69,11.8 31.91,13.02 v32.23,13.02 32.28,13.07 IC1.10 | R5.1 21,5.51 21.59,4.92 | R6.1 26.4,5.03 26.51,4.92 | IC1.13 36.1,9.26 C3.2 | IC1.12 IC1.13
  Bottom 0.61: 31.27,56.83 25.4,56.83 v24.29,55.72 | 21.59,4.92 26.51,4.92 v28.42,4.92 v32.23,4.92 40.8,4.92 41.75,5.87 50.32,5.87 51.28,4.92 v74.45,4.92 77.31,4.92 80.17,7.78 133.67,7.78 136.45,4.99 147.09,5.01 150.18,8.1 208.76,8.1 211.93,4.92 v226.85,4.92 247.33,4.92 249.24,3.02 251.97,3.02 254.99,6.03 300.36,6.03 v303.37,3.02 v316.23,3.02 341.47,3.02 v344.65,6.19 367.12,6.19 v367.21,6.28 | RN1.1 M1.B2 v316.23,43.46 M1.A2 | v339.88,76.04 340.52,76.68 v364.49,76.68 378.47,76.68 J1.4 | v374.49,43.58 367.03,43.58 366.71,43.58 v365.6,43.58 | v365.5,49.19 365.5,49.23 359.45,55.28 340.08,55.28 v339.88,55.09 340,55.2 338.77,53.98 318.04,53.98 M1.C2
A3
  Top 0.254: M2.20 323.36,80.99 J6.4
COL0  (via drill 0.35)
  Top 0.254: v295.8,88.68 295.69,88.68 285.07,78.06 SW48.1 280.84,50.49 273.64,43.3 273.64,33.34 SW63.1 | SW17.1 | SW17.1 357.47,88.78 357.47,84.27 356.39,83.19 SW33.1 356.39,68.91 356.99,68.3 356.99,66.2 | v290.67,31.27 290.67,27.47 v293.57,24.57 | 356.99,66.2 356.99,65.7 356.39,65.1 SW49.1 356.39,49.85 356.99,49.25 356.99,46.65 356.39,46.05 SW65.1 | SW17A.2 SW33A.2 SW49A.2 344.02,33.34 SW65A.2 344.02,30.84 341.83,28.65 341.83,24.41 v339.33,21.91 | v357.19,66.2 356.99,66.2
  Bottom 0.254: v295.8,88.68 295.89,88.59 SW16.1 | SW63.1 277.45,31.44 278.06,32.04 280.88,32.04 281.65,31.27 v290.67,31.27 294.42,31.27 SW64.1 | SW17A.2 344.02,90.88 346.26,93.12 354.71,93.12 356.39,91.44 SW17.1 | v293.57,24.57 295,23.14 M1.A10 326,23.14 327.23,21.91 v339.33,21.91 | J1.13 381.09,61.68 364.09,61.68 359.57,66.2 v357.19,66.2
COL1  (via drill 0.35)
  Top 0.254: SW5.1 89.8,88.44 88.25,88.44 80.51,80.7 SW21.1 | SW20.1 59.86,69.54 57.63,67.31 v57.63,50.49 | v57.63,50.49 v57.63,50.48 v57.63,50.49 | SW51.1 43.97,32.78 v43.97,35.72 43.66,36.04 43.66,48.9 45.25,50.49 SW36.1 | v307.5,21.59 307.5,23.27 M1.A9 | v379.1,28.73 382.2,31.84 J1.19 | v55.12,24.74 55.1,24.74 53.02,26.81 v53.02,32.71
  Bottom 0.254: SW20.1 63.38,69.54 63.98,70.14 66.58,70.14 67.19,69.54 SW21.1 | SW4.1 72.81,88.59 73.42,89.19 76.22,89.19 76.99,88.42 89.78,88.42 SW5.1 | SW36.1 48.98,50.49 49.58,51.09 52.18,51.09 52.78,50.49 v57.63,50.49 SW37.1 | v43.97,35.72 43.72,35.97 34.23,35.97 31.53,33.28 SW51A.2 31.53,29.13 Q3.2 | SW51.1 v53.02,32.71 55.32,32.71 SW52.1 | v379.1,28.73 379.1,28.1 378.14,27.15 364.33,27.15 357.5,20.32 327.59,20.32 326.32,21.59 v307.5,21.59 216.38,21.59 213.2,24.77 67.79,24.77 67.76,24.74 v55.12,24.74
COL2  (via drill 0.35)
  Top 0.254: SW23.1 118.59,81.44 125.74,88.59 SW7.1 | SW22.1 97.96,69.54 96.2,67.79 v96.2,50.49 | v96.2,50.49 v96.2,50.48 v96.2,50.49 | v96.2,50.49 99.84,46.85 v99.84,36.35 99.58,36.35 SW54.1 | v379.72,36.64 v379.73,36.65 379.73,52.79 378.3,54.22 378.3,56.35 J1.18
  Bottom 0.254: SW22.1 101.45,69.54 102.06,70.14 104.96,70.14 105.57,69.53 SW23.1 | SW6.1 110.89,88.59 111.5,89.19 114.1,89.19 114.7,88.59 SW7.1 | SW38.1 87.06,50.49 87.66,51.09 90.26,51.09 90.86,50.49 v96.2,50.49 SW39.1 | SW53.1 77.53,31.44 78.14,32.04 81.15,32.04 81.76,31.43 SW54.1 | v99.84,36.35 100.97,36.35 102.55,34.77 110.58,34.77 111.99,36.17 159.54,36.2 161.29,34.45 170.66,34.45 172.4,36.2 215.74,36.2 217.65,34.29 223.49,34.29 225.83,36.64 264.04,36.63 266.7,33.97 279.84,33.97 281.27,35.4 282.57,35.4 282.73,35.4 283.53,34.61 284.18,33.95 298.27,33.95 300.5,31.73 303.56,31.73 306.74,28.54 309.59,28.54 M1.A8 325.24,28.22 326.39,29.37 339.25,29.37 346.16,36.28 360.05,36.28 361.88,34.44 377.52,34.44 v379.72,36.64 | v99.84,36.35 99.82,36.38 v99.84,36.35
COL3  (via drill 0.35)
  Top 0.254: SW25.1 156.67,81.58 163.68,88.59 SW9.1 | SW24.1 137.08,68.99 135.53,68.99 134.14,67.6 v134.14,50.16 134.34,49.97 134.34,37.28 v134.04,36.98 134.04,32.73 SW56.1 | v380.81,38.85 380.84,38.85 380.84,56.35 J1.17
  Bottom 0.254: SW24.1 139.53,69.54 140.14,70.14 143.06,70.14 143.67,69.53 SW25.1 | SW8.1 148.97,88.59 149.58,89.19 152.18,89.19 152.78,88.59 SW9.1 | SW40.1 125.14,50.49 125.74,51.09 128.77,51.09 129.7,50.16 v134.14,50.16 141.94,50.16 SW41.1 | SW55.1 115.61,31.44 116.22,32.04 118.82,32.04 119.42,31.44 SW56.1 | v134.04,36.98 134.06,36.99 159.7,36.99 161.61,35.08 170.02,35.08 171.93,36.99 215.74,36.99 217.81,34.92 223.38,34.92 225.62,37.16 264.3,37.16 267.02,34.45 279.62,34.45 281.05,35.88 283.05,35.88 284.48,34.45 298.51,34.45 300.58,32.38 308.09,32.38 309.71,30.76 M1.A7 325.72,30.76 326.87,31.91 338.86,31.91 344.02,37.07 360.36,37.07 362.44,34.99 376.94,34.99 v380.81,38.85
COL4  (via drill 0.35)
  Top 0.254: SW27.1 194.75,81.24 202.09,88.58 SW11.1 | SW26.1 173.68,69.54 172.4,68.26 v172.4,50.48 v172.4,39.69 172.4,33.01 SW58.1 | M1.A6 314.96,38.35 314.96,54.77 v314.64,55.09
  Bottom 0.254: SW26.1 177.62,69.54 178.22,70.14 180.84,70.14 181.45,69.53 SW27.1 | SW10.1 187.06,88.59 187.66,89.19 190.26,89.19 190.87,88.59 SW11.1 | SW42.1 163.22,50.49 163.82,51.09 166.71,51.09 167.32,50.48 v172.4,50.48 SW43.1 | SW57.1 153.69,31.44 154.3,32.04 157.35,32.04 157.96,31.43 SW58.1 | M1.A6 309.4,33.81 303.21,33.81 301.31,35.72 287.34,35.72 280.04,43.02 263.84,43.02 263.36,42.55 248.76,42.55 248.28,43.02 214.05,43.02 210.71,39.69 v172.4,39.69 | v314.64,55.09 335.28,55.09 337.34,57.15 369.33,57.15 371.8,59.61 378.91,59.61 379.55,60.25 J1.16
COL5  (via drill 0.35)
  Top 0.254: SW29.1 232.83,80.75 240.67,88.59 SW13.1 | SW28.1 211.78,69.54 210.5,68.26 v210.5,50.48 v210.5,40.8 210.5,33.03 SW60.1 | v364.4,45.51 364.44,45.56 364.44,51.63 v369.11,56.3
  Bottom 0.254: SW28.1 215.69,69.54 216.3,70.14 218.9,70.14 219.5,69.54 SW29.1 | SW12.1 225.13,88.59 225.74,89.19 228.47,89.19 229.08,88.58 SW13.1 | SW44.1 201.29,50.49 201.9,51.09 204.55,51.09 205.16,50.48 v210.5,50.48 SW45.1 | SW59.1 191.78,31.44 192.38,32.04 194.98,32.04 195.59,31.44 SW60.1 | J1.15 380.93,58.98 378.78,58.98 371.99,58.98 369.31,56.3 v369.11,56.3 | v210.5,40.8 211,40.8 213.7,43.5 248.92,43.5 249.4,43.02 262.87,43.02 263.35,43.5 302.89,43.5 309.91,36.48 M1.A5 310.03,35.72 324.96,35.72 326.39,37.15 330.2,37.15 331.15,37.15 332.9,35.4 336.16,35.4 336.19,35.36 340.04,39.21 358.1,39.21 v364.4,45.51
COL6  (via drill 0.35)
  Top 0.254: SW31.1 270.91,80.73 278.77,88.59 SW15.1 | SW46.1 234.8,50.49 227.97,43.66 227.97,31.45 SW61.1 | v252.41,50.48 v252.41,50.49 | SW30.1 250.2,69.54 248.6,67.94 248.6,55.56 252.41,51.75 v252.41,50.48 | v262.41,43.97 262.38,43.94 262.38,33.19 SW62.1 | v252.41,50.48 v252.41,43.97 252.41,33.36 SW62A.2 | J1.14 379.66,62.77 v377.29,60.41 | v311.47,56.04 311.47,39.94 M1.A4
  Bottom 0.254: SW30.1 253.78,69.54 254.38,70.14 257.04,70.14 257.65,69.53 SW31.1 | SW14.1 263.21,88.59 263.82,89.19 266.42,89.19 267.02,88.59 SW15.1 | SW15.1 | SW46.1 239.38,50.49 239.98,51.09 242.58,51.09 243.19,50.49 v252.41,50.49 SW47.1 | v252.41,43.97 252.57,44.13 262.25,44.13 v262.41,43.97 262.57,43.97 262.73,44.13 303.06,44.13 308.81,38.38 M1.A4 | v377.29,60.41 371.58,60.41 369.12,57.94 337.03,57.94 335.12,56.04 v311.47,56.04
COL7  (via drill 0.35)
  Top 0.254: SW2.1 32.76,88.52 31.21,88.52 29.57,86.88 29.57,70.98 SW18.1 | SW50.1 8.99,42.92 5.4,46.51 5.4,48.74 7.15,50.49 SW34.1 8.99,61.16 SW18A.2 | SW66.1 127.48,22.48 127.48,38.42 v127.48,38.73 117.95,48.26 103.59,62.62 v103.59,62.76 | v38.89,65.56 38.89,70.65 v39.05,70.81 | v369.83,54.77 366.8,51.74 366.8,47.27 v366.7,47.18
  Bottom 0.254: SW1.1 18.07,92.87 28.55,92.87 SW2.1 33.62,89.38 51.08,89.38 SW3.1 | SW18A.2 17.37,69.86 21.96,74.45 27.94,74.45 29.84,72.55 29.84,70.92 SW18.1 v39.05,70.81 41.16,70.81 SW19.1 | v38.89,65.56 41.7,62.76 v103.59,62.76 | v127.48,38.73 133.51,44.77 306.07,44.77 M1.A3 325.48,40.92 326.71,39.69 331.47,39.69 332.58,40.8 346.71,40.8 347.66,39.85 357.31,39.85 364.47,47.01 364.64,47.18 v366.7,47.18 | v369.83,54.77 370.22,55.17 J1.20
GND  (via drill 0.35)
  Top 0.254: v54.61,11.91 v54.61,3.81 | v207.49,12.06 v207.49,6.67
  Top 0.406: v31.11,10.95 31.11,4.13 v30.8,3.81
  Top 0.61: M2.3 M2.4 | v304.39,54.73 304.39,58.99 v303.69,59.69 303.59,59.79 SW32A.2 303.59,72.49 v314.55,83.44 | v21.27,55.4 22.86,53.82 v22.86,50.48 v22.86,40.8 v22.86,15.56 22.86,12.7 v22.54,12.38 22.86,12.06 v22.86,6.19 v22.86,3.49 | J8.2 384.02,85.98 384.02,79.85 J1.1 | v309.88,52.23 309.91,52.2 M1.A1 306.55,42.64 306.55,11.59 | J4.2 384.02,9.55 384.02,16.77 J7.4 | 306.55,11.59 v306.55,9.84 v306.55,1.59 | v375.2,18.69 v375.2,18.7 365.28,28.61 365.28,38.89 v364.97,39.21 | C4.K 306.55,11.59 | J5.1 300.2,15.88 300.2,11.43 J5.4 | v330.98,83.53 J6.1
  Bottom 0.254: Q1.2 22.93,40.87 v22.86,40.8 | v364.97,39.21 364.29,38.53 364.29,37.7 Q5.2 | JP1.1 55.11,12.41 v54.61,11.91 | JP2.1 207.82,12.4 v207.49,12.06
  Bottom 0.406: C2.1 24.27,6.19 v22.86,6.19 | v22.54,12.38 22.47,12.45 Q2.2 21.15,13.91 C1.1 | IC1.7 22.91,15.61 v22.86,15.56 | C3.1 35.33,11.34 34.87,11.8 IC1.11 32.12,11.8 31.27,10.95 v31.11,10.95
  Bottom 0.61: M2.3 v330.98,83.53 M2.23 318.19,83.44 v314.55,83.44 | SW32.1 291.59,62.82 291.59,61.02 292.86,59.75 303.63,59.75 v303.69,59.69 | v304.39,54.73 v304.39,54.72 306.88,52.23 v309.88,52.23 313.69,52.23 M1.C1 | v21.27,55.4 21.21,55.4 4.6,72.01 4.6,76.83 2.81,78.62 J3.2 | SW35.1 v22.87,50.49 v22.86,50.48 | v22.86,3.49 23.18,3.81 v30.8,3.81 41.91,3.81 42.86,4.76 49.37,4.76 50.32,3.81 v54.61,3.81 56.99,3.81 77.79,3.81 80.64,6.67 132.87,6.67 135.73,3.81 148.43,3.81 151.29,6.67 200.98,6.67 v207.49,6.67 208.3,6.67 211.14,3.83 211.14,3.81 246.22,3.81 248.44,1.59 260.03,1.59 263.05,4.6 297.66,4.6 300.67,1.59 v306.55,1.59 341.79,1.59 345.28,5.08 379.55,5.08 J4.2 | M2.4 341.29,78.45 341.79,77.95 357.66,77.95 357.75,78.03 376.87,78.03 378.3,79.46 380.77,79.46 J1.1 | M1.A1 M1.B1 | J7.4 382.1,18.69 v375.2,18.69 | v375.2,18.69 375.18,18.67 v375.2,18.69 | J5.4 v306.55,9.84
  other vias: 69,25.8 220.2,24.2 183.1,33 182.4,35 143.9,33.1 143.9,35 106.6,33.2 88.9,34.9 117,54.1 193.8,48.9 213,48.4 230.9,51 224.3,33.3 230.9,54.1 91.5,71.2 85,72.2 55.4,72 83.6,91.4 80,94.7 72.2,92 118,91.1 204.8,73.3 204.5,71.3 197.5,92.4 183.2,91.8 200.3,90.4 221.4,94 235.3,90.6 234.1,72.9 245.2,71.2 322.8,46.5 321.7,29.4 304.7,37.2 321.8,33.1 321.6,26 321.9,38 325.8,35.4 340.4,35.3 341.1,21.5 321,22.4 319.3,19.4 306.6,27.2 292.1,32.4 295.1,24.3 365.8,59.5 370,62.8 363.5,64.4 363.6,73.5 358.6,62 340.6,40 335.4,30.4 167.1,71.3 153.9,54.1 182.4,54 131.3,71.1 149.9,72.9
  pour Top: 0.5,0.5 0.5,95.8 385,95.8 385,0.5
  pour Bottom (isolate 0.254): 0.5,0.5 385,0.5 385,95.8 0.5,95.8
KSW_A13  (via drill 0.35)
  Top 0.254: v275.33,16.56 286.86,28.09 286.86,38.03 296.23,47.4 296.23,57.15 v297.81,58.74
  Bottom 0.254: J2.1 273.65,14.88 v275.33,16.56 | v297.81,58.74 308.13,58.74 315.15,65.75 M2.16
KSW_A14  (via drill 0.35)
  Top 0.254: v272.83,12.64 287.34,27.15 287.34,37.62 296.78,47.07 296.78,56.81 297.75,57.78 v298.45,57.78
  Bottom 0.254: J2.2 272.53,12.34 v272.83,12.64 | v298.45,57.78 308.77,57.78 314.19,63.21 M2.15
KSW_A15  (via drill 0.35)
  Top 0.254: v271.81,10.12 287.81,26.12 287.81,37.31 300.18,49.67 301.92,49.67 306.57,54.32 v306.57,54.45
  Bottom 0.254: J2.3 271.49,9.8 v271.81,10.12 | v306.57,54.45 306.57,54.47 312.74,60.64 318.25,60.64 M2.14
LOCK
  Bottom 0.254: IC1.3 28.55,10.48 27.46,10.48 27.39,10.55 Q2.3 21,9.75 R5.2
N$1
  Bottom 0.254: R1.1 30.52,42.82 SW35.LDA
N$2
  Bottom 0.254: SW35.LDC 36.69,42.87 Q1.3
N$3
  Bottom 0.254: Q1.1 37.74,39.07 R2.1
N$4
  Bottom 0.254: Q2.1 19.1,12.6 R4.1
N$5  (via drill 0.35)
  Top 0.254: v30,9.37 v30,14.29
  Bottom 0.254: IC1.2 29.9,9.26 v30,9.37 | v30,14.29 28.66,14.29 IC1.6
N$6
  Bottom 0.254: IC1.1 R6.2 C2.2
N$7
  Bottom 0.254: R7.1 D1.K
N$8
  Bottom 0.254: R7.2 24.51,27.95 Q3.1
N$9
  Bottom 0.254: Q5.1 364.31,35.85 362.59,37.57 R18.1
N$10
  Top 0.254: J8.1 381,89.14 381,86.44 382.18,85.26 J8.3 | J3.3 3.65,79.93 3.65,77.32 J3.1
  Bottom 0.254: J3.3 15.23,93.98 41.27,93.98 43.34,91.92 43.97,91.92 53.24,91.92 54.81,93.48 97.25,93.48 99.21,91.52 113.73,91.52 115.5,93.28 153.71,93.28 155.63,91.36 162.79,91.36 165.42,93.98 166.37,93.98 212.41,93.98 214.47,91.92 214.63,91.92 222.73,91.92 224.79,93.98 225.11,93.98 268.29,93.98 270.35,91.92 278.13,91.92 280.19,93.98 326.23,93.98 328.37,91.84 329.33,91.84 337.58,91.84 339.73,93.98 341.15,93.98 361.16,93.98 362.74,92.39 364.25,92.39 R11.1 366.6,90.04 381.9,90.04 J8.1
N$11
  Bottom 0.254: Q5.3 367.06,37.58 R19.2
N$12  (via drill 0.35)
  Top 0.254: v370.52,39.29 v370.52,41.83 370.52,44.23 v371.09,44.8
  Bottom 0.254: SPK1.1 v371.09,44.8 370.14,44.8 D2.A | v370.52,39.29 R19.1 | R20.1 368.97,41.83 v370.52,41.83
N$13
  Bottom 0.254: R16.2 J5.2
N$14
  Bottom 0.254: JP1.2 61.35,12.41 SW67.1
N$15
  Bottom 0.203: JP2.2 210.01,12.4 210.03,12.38
  Bottom 0.254: 210.03,12.38 SW68.1
PWRLED  (via drill 0.35)
  Top 0.152: JP3.1
  Top 0.254: v357.17,58.63 360.52,61.98 360.52,88.9 v361.95,90.33 | JP3.1 v364.49,88.74
  Bottom 0.254: M2.12 334,58.61 357.14,58.61 v357.17,58.63 | v361.95,90.33 364.17,90.33 R11.2 364.3,88.74 v364.49,88.74
RGBOUT  (via drill 0.35)
  Top 0.254: M2.9 335.93,63.34 336.07,63.34 337,62.41 337,27.46 v326.73,17.18
  Bottom 0.254: v326.73,17.18 308.32,17.18 R16.1
ROW0  (via drill 0.35)
  Top 0.254: v324.66,89.24 324.66,87.02 326.07,85.61 v326.07,66.99 326.07,42.54 M1.B3
  Bottom 0.254: SW2.2 54.78,91.13 56.36,92.71 75.68,92.71 SW4.2 77.27,91.13 79.01,92.87 96.79,92.87 98.63,91.03 115.24,91.03 SW6.2 115.34,91.21 116.68,92.55 152,92.55 SW8.2 154.12,90.43 164.09,90.43 166.21,92.55 190.08,92.55 SW10.2 201.46,91.13 202.88,92.55 211.17,92.55 212.89,90.83 229.28,90.83 SW12.2 229.6,91.13 231.02,92.55 266.24,92.55 SW14.2 278.61,91.13 280.04,92.55 304.32,92.55 SW16.2 307.63,89.24 v324.66,89.24 | M1.B3 RN1.2 | v326.07,66.99 338.71,66.99 345.85,74.14 355.92,74.14 357.9,72.16 357.9,69.5 357.9,69.1 359.8,67.2 361.67,65.33 J1.12
ROW1  (via drill 0.35)
  Top 0.254: v24.75,88.22 24.75,79.47 v28.65,75.56 | v265.43,54.45 265.43,65.88 259.23,72.08 SW30.2 | RN1.3 329.72,39.56 329.72,50.8 v329.88,50.96 329.72,51.12 329.72,56.67 v331.31,58.26 | v365.86,62.52 364.02,60.69 v364.01,60.69
  Bottom 0.254: SW30.2 251.63,72.08 249.87,70.33 238.28,70.33 236.53,72.08 SW28.2 213.53,72.08 211.61,70.17 200.34,70.17 199.22,71.29 182.85,71.29 SW26.2 170.43,72.08 168.84,70.48 161.93,70.48 160.33,72.08 SW24.2 137.01,72.08 135.11,70.19 124.12,70.19 122.23,72.08 SW22.2 98.59,72.08 96.84,70.33 84.76,70.33 83.01,72.08 SW20.2 67.02,71.28 59.69,71.28 58.9,70.48 45.56,70.48 40.48,75.56 v28.65,75.56 | v24.75,88.22 21.84,91.13 SW1.2 | M1.B4 RN1.3 | J1.11 380.93,64.06 378.78,64.06 367.39,64.06 v365.86,62.52 | v265.43,54.45 267.65,52.23 290.62,52.23 SW48.2 291.46,53.03 293.53,50.96 v329.88,50.96 | v331.31,58.26 332.42,59.37 347.98,59.37 348.14,59.21 355.44,59.21 356.92,60.69 v364.01,60.69
ROW2  (via drill 0.35)
  Top 0.254: v43.61,53.08 32.28,64.41 SW18.2 | v323.84,32.07 323.92,32.07 M1.B5 | v249.56,38.89 249.56,49.05 245.58,53.03 SW46.2 | v362.05,41.18 363.35,42.48 363.35,52.92 378.3,67.87 J1.10
  Bottom 0.254: SW18A.1 20.46,62.64 20.46,61.09 21.62,59.93 28.03,59.93 32.28,64.18 SW18.2 | SW46.2 241.9,54.95 207.64,54.95 205.74,53.05 SW44.2 203.82,54.95 180.21,54.95 178.28,53.03 SW42.2 165.54,55.15 142.62,55.15 140.5,53.03 SW40.2 127.66,54.95 104.48,54.95 102.56,53.03 SW38.2 89.48,55.05 70.78,55.05 68.76,53.03 SW36.2 53.37,53.08 v43.61,53.08 | M1.B5 RN1.4 332.01,34.73 336.83,34.73 340.68,38.58 358.62,38.58 361.22,41.18 v362.05,41.18 | v323.84,32.07 323.68,31.91 309.52,31.91 308.4,33.03 301.89,33.03 SW64.2 299.84,35.08 284.64,35.08 283.37,36.35 280.68,36.35 279.25,34.92 267.33,34.92 263.84,38.42 250.03,38.42 v249.56,38.89
ROW3  (via drill 0.35)
  Top 0.254: v338.14,69.22 339.09,68.26 339.09,33.66 v338.14,32.7 338.14,26.39 v339.6,24.93 v339.6,24.92 | v332.08,69.63 326.98,74.73 326.98,86.06 v326.52,86.52
  Bottom 0.254: SW3.2 75.24,91.13 76.68,89.69 86.2,89.69 87.64,91.13 SW5.2 97.07,90.36 113.78,90.36 114.44,89.69 120.33,89.69 121.76,91.12 SW7.2 151.44,91.13 152.88,89.69 164.62,89.69 166.06,91.13 SW9.2 189.54,91.13 190.98,89.69 201.77,89.69 203.21,91.13 SW11.2 211.65,90.02 228.43,90.02 228.76,89.69 240.66,89.69 242.1,91.13 SW13.2 265.42,91.13 266.7,89.85 278.76,89.85 280.04,91.13 SW15.2 303.21,91.12 305.71,88.62 324.12,88.62 326.22,86.52 v326.52,86.52 | M1.B6 RN1.5 330.94,33.34 331.57,32.7 v338.14,32.7 | SW65.2 358.93,25.08 355.68,21.83 347.9,21.83 346.56,23.17 SW65A.1 344.34,25.09 344.33,25.08 339.75,25.08 v339.6,24.92 | J1.5 380.93,71.68 362.7,71.68 359.6,74.77 345.38,74.77 339.82,69.22 v338.14,69.22 334.96,69.22 334.55,69.63 v332.08,69.63
ROW4  (via drill 0.35)
  Top 0.254: v220.92,29.42 v220.92,29.43 216.37,33.98 SW60.2 | SW66.2 143.92,28.17 v149.72,33.97 v149.72,33.98 | v361.31,83.5 361.83,82.98 v361.83,70.41 361.83,61.52 357.66,57.36 v357.66,56.36 | SW62A.1 253.03,23.47 v256.22,20.28 | SW62.2 265.43,26.33 v265.43,20.48 | v322.31,17.96 322.71,17.96 326.11,21.36 326.11,29.18 M1.B7 | v341.83,33.87 341.83,54.9 v343.29,56.36
  Bottom 0.254: SW52.2 64.68,35.72 99.28,35.72 SW54.2 110.5,33.98 112.08,35.56 137.52,35.56 SW56.2 v149.72,33.98 149.72,33.99 151.29,35.56 159.41,35.56 161.15,33.82 177.02,33.82 SW58.2 187.97,33.98 189.23,35.24 189.55,35.56 213.68,35.56 SW60.2 | SW62A.1 225.25,25.09 v220.92,29.42 | M1.B7 RN1.6 331.5,31.36 339.32,31.36 v341.83,33.87 | SW17A.1 346.56,79.84 347.66,78.74 355.12,78.74 358.93,82.55 SW17.2 | SW17.2 | v361.83,70.41 J1.8 | v361.31,83.5 SW17.2 | v256.22,20.28 265.23,20.28 v265.43,20.48 303.87,20.48 306.42,17.93 322.29,17.93 v322.31,17.96 | v343.29,56.36 v357.66,56.36
ROW5  (via drill 0.35)
  Top 0.254: v77.95,53.03 77.95,45.03 71.28,38.37 v71.25,38.37 | SW33A.1 346.56,50.49 344.96,48.9 344.96,33.34 345.44,32.86 345.44,30.8 342.9,28.26 v342.74,28.26 | SW33.2 358.93,68.13 v359.83,69.04 | v285.75,39.05 285.75,42.7 v280.51,47.94 | v333.69,33.66 333.69,28.42 v333.53,28.26
  Bottom 0.254: SW37.2 v77.95,53.03 89.53,53.03 90.81,51.75 102.87,51.75 104.15,53.03 SW39.2 127.63,53.03 129.22,51.44 140.34,51.44 141.93,53.03 SW41.2 165.57,53.03 167,51.59 178.59,51.59 180.03,53.03 SW43.2 203.77,53.03 205.06,51.73 206.51,51.73 207.81,53.03 SW45.2 241.61,53.03 243.21,51.44 254.63,51.44 256.23,53.03 SW47.2 264.29,51.6 276.85,51.6 v280.51,47.94 | SW50.2 18.51,37.15 44.61,37.15 46.67,35.08 54.29,35.08 57.57,38.37 v71.25,38.37 | M1.B8 RN1.7 330.94,28.26 v333.53,28.26 v342.74,28.26 | SW33.2 358.93,64.13 354.65,59.85 348.35,59.85 346.63,61.57 346.63,63.12 SW33A.1 | J1.7 380.83,69.04 v359.83,69.04 | v285.75,39.05 287.5,39.05 290.19,36.35 301.47,36.35 303.21,34.61 331.31,34.61 332.26,33.66 v333.69,33.66
ROW6  (via drill 0.35)
  Top 0.254: SW49A.1 346.56,30.96 344.33,28.73 v344.33,27.62 | SW49.2 358.93,57.5 374.48,73.05 v374.64,73.05 | v272.1,28.26 272.1,30.32 272.57,30.8 272.57,44.13 282.89,54.45 282.89,68.1 278.92,72.08 SW31.2
  Bottom 0.254: SW19.2 50.08,73.38 63.62,73.38 63.67,73.33 85.61,73.33 SW21.2 97,72.08 98.74,73.82 123.2,73.82 SW23.2 135.42,72.08 137,73.66 161.44,73.66 SW25.2 168.09,72.08 169.67,73.66 182.69,73.66 184.27,72.08 SW27.2 211.94,72.08 213.52,73.66 237.6,73.66 SW29.2 249.56,72.08 251.14,73.66 275.68,73.66 SW31.2 | SW49.2 358.93,43.81 355.76,40.64 348.3,40.64 346.55,42.39 SW49A.1 | v344.33,27.62 342.39,25.68 RN1.8 M1.B9 326.38,26.99 308.93,26.99 307.5,25.56 307.5,25.4 297.12,25.4 296.17,26.35 284.8,26.35 283.69,25.24 275.12,25.24 v272.1,28.26 | J1.6 379.56,73.05 v374.64,73.05
ROW7  (via drill 0.35)
  Top 0.254: v18.26,50.76 20.36,48.66 20.36,36.31 v20.42,36.25 | v29.25,29.33 29.41,29.33 31.11,27.62 v31.11,26.05 | v31.11,26.05 31.11,26.04 v31.11,26.05 | v367.26,29.02 373.38,35.13 373.38,61.24 378.74,66.6 380.93,66.6 J1.9 | v289.08,32.23 289.08,27.83 291.41,25.5 v291.56,25.5
  Bottom 0.254: SW51.2 46.51,26.36 | 46.51,26.36 57.3,26.36 58.1,25.56 66.04,25.56 74.46,33.98 SW53.2 97.94,33.98 99.54,32.38 111.76,32.38 113.36,33.98 SW55.2 136.2,33.98 138.11,32.07 149.7,32.07 151.61,33.98 SW57.2 159.25,32.87 175.73,32.87 176.53,32.07 187.96,32.07 189.87,33.98 SW59.2 212.08,33.98 214,32.07 225.9,32.07 227.02,33.19 233.51,33.19 SW61.2 236.36,36.04 263.84,36.04 266.38,33.5 281.42,33.5 SW63.2 282.89,32.98 288.32,32.98 v289.08,32.23 | Q3.3 v31.11,26.05 33.11,26.05 SW51A.1 34.07,22.92 35.16,21.83 43.58,21.83 46.51,24.77 46.51,26.36 | SW34.2 15.99,53.03 v18.26,50.76 | v20.42,36.25 22.33,36.25 v29.25,29.33 | v367.26,29.02 364.93,29.02 357.03,21.11 347.35,21.11 345.32,23.14 RN1.9 M1.B10 327.65,23.14 326.35,24.45 297.14,24.45 296.09,25.5 v291.56,25.5
RX  (via drill 0.35)
  Top 0.254: v328.45,85.09 328.45,90.59 J6.2
  Bottom 0.254: M2.2 331.96,85.09 v328.45,85.09
SCL  (via drill 0.35)
  Top 0.254: v325.3,73.18 322.42,70.31 322.42,53.22 321.41,52.2 M1.C4 321.34,52.1 319.4,50.16 319.4,25.8 v324.3,20.9
  Bottom 0.254: R13.1 333.59,73.3 M2.6 333.33,73.18 v325.3,73.18 | v324.3,20.9 325.52,19.68 358.14,19.68 364.67,26.21 J7.1
SDA  (via drill 0.35)
  Top 0.254: v324.59,75.68 321.67,72.77 321.67,54.99 318.88,52.2 M1.C3 318.8,22.48 v321.79,19.49
  Bottom 0.254: R12.1 333.61,76 M2.5 333.29,75.68 v324.59,75.68 | v321.79,19.49 322.19,19.09 358.82,19.09 363.54,23.81 382.06,23.81 J7.2
SHIFTLOCK  (via drill 0.35)
  Top 0.254: v26.99,13.02 26.99,20.8 v26.83,20.95 26.83,38.58 v27.15,38.89
  Bottom 0.254: IC1.5 27.2,13.07 27.15,13.02 v26.99,13.02 | v26.83,20.95 26.77,20.9 D1.A | v27.15,38.89 27.27,39.02 R2.2
SND_OUT  (via drill 0.35)
  Top 0.254: M2.8 337.98,63.83 337.98,35.24 v338.3,34.92
  Bottom 0.254: v338.3,34.92 341.15,37.78 359.97,37.78 R18.2
TX
  Bottom 0.254: M2.1 329.27,86.07 329.25,86.04 325.75,89.53 325.75,90.45 J6.3

### Text on the board
Bottom: 223/00
tNames: DNP | Close JP3 only / if no Pro Micro / is installed! | +5V | A3 | TX | RX | GND | 1.5U | 1.5U | 1.5U | 1.5U | screw mount / stabilizer 2U | 2U | 1.5U | 1.5U | 1.5U | 1.5U | screw mount / stabilizer 7U | Rev.0 | http://github.com/ / svenpetersen1965 | 7U
bNames: 1 | + | - | PWR LED | + | PWR LED | + | - | + | 1 | KEYBOARD | + | - | µC Circuit | Configure M1: / A[0..2] = GND | Speaker Circuit | 1 | SCL | SDA | I²C | RGB LED Circuit | +5V | 1 | GND | GND | 1 | Shift Lock Circuit | A13 | DOUT | A14 | +5V | 1 | A15 | KERNAL / SWITCHER | GND | Close for / ASSY 250469 | Jumper | !C64_RESET | RGB LEDs / WS2812B | !EXROM
Document: 223-2-01-00 | Sven Petersen / 2025 | 35µ | 2 | 0